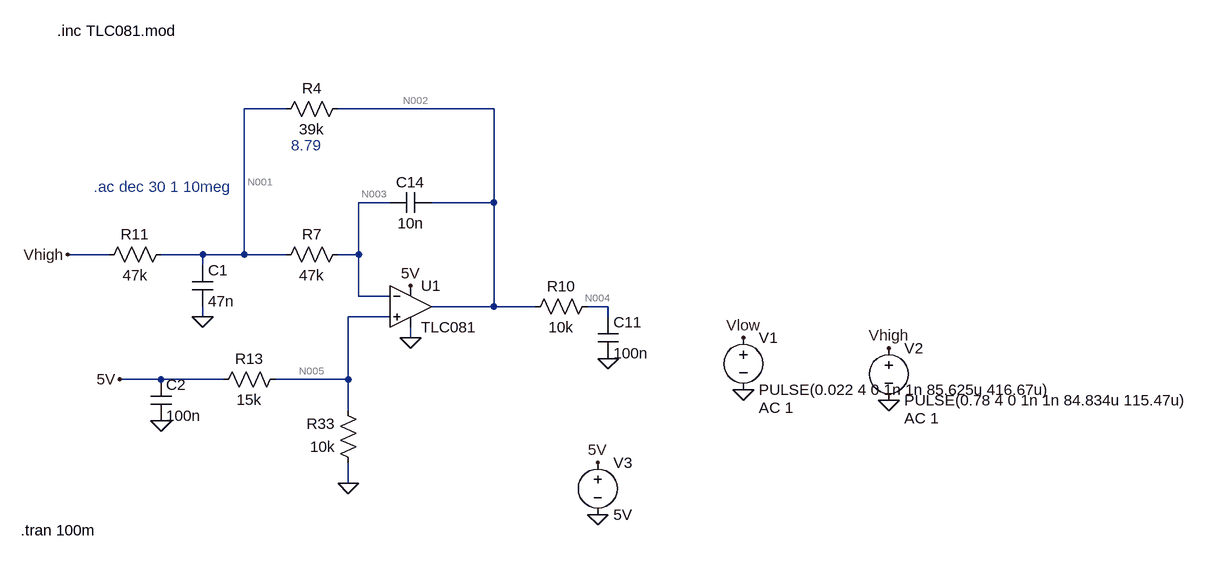
[diagram p0: schematic MFB new 5555.asc]
MFB new 5555.asc, the LTspice schematic file:
Version 4.1
SHEET 1 1768 680
WIRE 272 -112 208 -112
WIRE 592 -112 352 -112
WIRE 432 32 384 32
WIRE 592 32 592 -112
WIRE 592 32 496 32
WIRE 0 112 -64 112
WIRE 144 112 80 112
WIRE 208 112 208 -112
WIRE 208 112 144 112
WIRE 272 112 208 112
WIRE 384 112 384 32
WIRE 384 112 352 112
WIRE 144 128 144 112
WIRE 384 176 384 112
WIRE 432 176 384 176
WIRE 592 192 592 32
WIRE 592 192 496 192
WIRE 656 192 592 192
WIRE 768 192 736 192
WIRE 144 208 144 192
WIRE 432 208 368 208
WIRE 768 208 768 192
WIRE 464 240 464 224
WIRE 80 304 16 304
WIRE 176 304 80 304
WIRE 368 304 368 208
WIRE 368 304 256 304
WIRE 368 352 368 304
WIRE 368 464 368 432
FLAG -64 112 Vhigh
FLAG 16 304 5V
FLAG 368 464 0
FLAG 144 208 0
FLAG 976 320 0
FLAG 1200 336 0
FLAG 976 240 Vlow
FLAG 1200 256 Vhigh
FLAG 752 432 5V
FLAG 752 512 0
FLAG 464 160 5V
FLAG 464 240 0
FLAG 768 272 0
FLAG 80 368 0
SYMBOL res 96 96 R90
WINDOW 0 0 56 VBottom 2
WINDOW 3 32 56 VTop 2
SYMATTR InstName R11
SYMATTR Value 47k
SYMBOL res 368 96 R90
WINDOW 0 0 56 VBottom 2
WINDOW 3 32 56 VTop 2
SYMATTR InstName R7
SYMATTR Value 47k
SYMBOL res 272 288 R90
WINDOW 0 0 56 VBottom 2
WINDOW 3 32 56 VTop 2
SYMATTR InstName R13
SYMATTR Value 15k
SYMBOL res 384 448 R180
WINDOW 0 36 76 Left 2
WINDOW 3 36 40 Left 2
SYMATTR InstName R33
SYMATTR Value 10k
SYMBOL res 256 -96 R270
WINDOW 0 32 56 VTop 2
WINDOW 3 0 56 VBottom 2
SYMATTR InstName R4
SYMATTR Value 39k
SYMBOL OpAmps\\opamp2 464 128 R0
SYMATTR InstName U1
SYMATTR Value TLC081
SYMBOL cap 128 128 R0
SYMATTR InstName C1
SYMATTR Value 47n
SYMBOL voltage 976 224 R0
WINDOW 123 24 124 Left 2
WINDOW 39 0 0 Left 0
SYMATTR Value2 AC 1
SYMATTR InstName V1
SYMATTR Value PULSE(0.022 4 0 1n 1n 85.625u 416.67u)
SYMBOL voltage 1200 240 R0
WINDOW 123 24 124 Left 2
WINDOW 39 0 0 Left 0
SYMATTR Value2 AC 1
SYMATTR InstName V2
SYMATTR Value PULSE(0.78 4 0 1n 1n 84.834u 115.47u)
SYMBOL voltage 752 416 R0
WINDOW 123 0 0 Left 0
WINDOW 39 0 0 Left 0
SYMATTR InstName V3
SYMATTR Value 5V
SYMBOL cap 496 16 R90
WINDOW 0 0 32 VBottom 2
WINDOW 3 32 32 VTop 2
SYMATTR InstName C14
SYMATTR Value 10n
SYMBOL res 752 176 R90
WINDOW 0 0 56 VBottom 2
WINDOW 3 32 56 VTop 2
SYMATTR InstName R10
SYMATTR Value 10k
SYMBOL cap 752 208 R0
SYMATTR InstName C11
SYMATTR Value 100n
SYMBOL cap 64 304 R0
SYMATTR InstName C2
SYMATTR Value 100n
TEXT -80 -232 Left 2 !.inc TLC081.mod
TEXT -136 536 Left 2 !.tran 100m
TEXT 280 -56 Left 2 ;8.79
TEXT -24 8 Left 2 ;.ac dec 30 1 10meg

The netlist it stands for:
* MFB new 5555.asc
R11 N001 Vhigh 47k
R7 N003 N001 47k
R13 N005 5V 15k
R33 0 N005 10k
R4 N001 N002 39k
X§U1 N005 N003 5V 0 N002 TLC081  ; pins In+ In- V+ V- OUT
C1 N001 0 47n
V1 Vlow 0 PULSE(0.022 4 0 1n 1n 85.625u 416.67u) AC 1
V2 Vhigh 0 PULSE(0.78 4 0 1n 1n 84.834u 115.47u) AC 1
V3 5V 0 5V
C14 N002 N003 10n
R10 N004 N002 10k
C11 N004 0 100n
C2 5V 0 100n
.inc TLC081.mod
.tran 100m
* 8.79
* .ac dec 30 1 10meg
.backanno
.end

* Results of the author's LTspice run, read from the files saved beside the schematic
* Operating Point, zero values left out:
*   V(5v) = 5 V
*   V(n001) = 2.001 V
*   V(n002) = 3.014 V
*   V(n003) = 2.001 V
*   V(n004) = 3.014 V
*   V(n005) = 2 V
*   V(vhigh) = 780 mV
*   V(vlow) = 22 mV
*   I(R11) = 25.98 µA
*   I(R13) = -200 µA
*   I(R33) = -200 µA
*   I(R4) = -25.98 µA
*   I(R7) = -2.633 pA
*   I(V2) = 25.98 µA
*   I(V3) = -1.156 mA
*   Ix(u1:1) = 2.63 pA
*   Ix(u1:2) = 2.633 pA
*   Ix(u1:3) = 955.7 µA
*   Ix(u1:4) = -956.6 µA
*   Ix(u1:5) = -25.98 µA
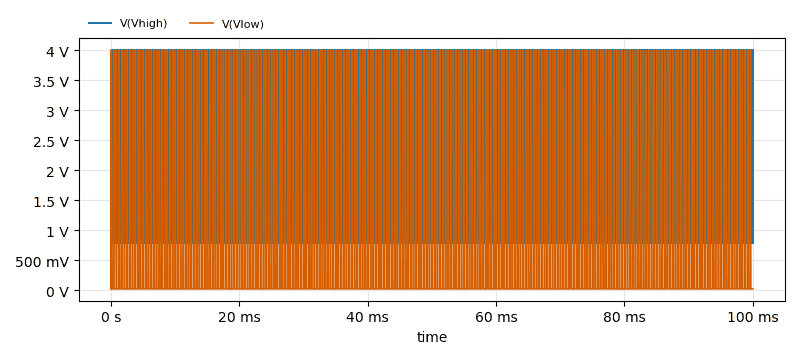
[diagram p1: Transient Analysis of MFB new 5555.asc, plotted from the saved traces]
* Transient Analysis, 1 run:
*   V(Vhigh): min 780 mV, max 4 V, average 3.146 V, rms 3.452 V, last 4 V
*   V(Vlow): min 22 mV, max 4 V, average 839.5 mV, rms 1.813 V, last 22 mV